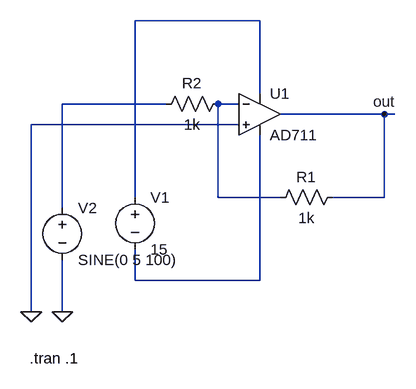
[diagram p0: schematic Amplifier.asc]
Amplifier.asc, the LTspice schematic file:
Version 4
SHEET 1 880 680
WIRE 192 16 0 16
WIRE 192 128 192 16
WIRE 48 144 -112 144
WIRE 160 144 128 144
WIRE 384 160 224 160
WIRE 400 160 384 160
WIRE 160 176 -160 176
WIRE 0 288 0 16
WIRE 128 288 128 144
WIRE 224 288 128 288
WIRE 384 288 384 160
WIRE 384 288 304 288
WIRE -112 304 -112 144
WIRE 0 416 0 368
WIRE 192 416 192 192
WIRE 192 416 0 416
WIRE -160 464 -160 176
WIRE -112 464 -112 384
FLAG 384 160 out
FLAG -160 464 0
FLAG -112 464 0
SYMBOL OpAmps\\AD711 192 96 R0
SYMATTR InstName U1
SYMBOL voltage 0 272 R0
WINDOW 123 0 0 Left 0
WINDOW 39 0 0 Left 0
SYMATTR InstName V1
SYMATTR Value 15
SYMBOL res 320 272 R90
WINDOW 0 0 56 VBottom 2
WINDOW 3 32 56 VTop 2
SYMATTR InstName R1
SYMATTR Value 1k
SYMBOL res 144 128 R90
WINDOW 0 0 56 VBottom 2
WINDOW 3 32 56 VTop 2
SYMATTR InstName R2
SYMATTR Value 1k
SYMBOL voltage -112 288 R0
WINDOW 123 0 0 Left 0
WINDOW 39 0 0 Left 0
SYMATTR InstName V2
SYMATTR Value SINE(0 5 100)
TEXT -162 536 Left 2 !.tran .1

The netlist it stands for:
* Amplifier.asc
XU1 0 N003 N001 N004 out AD712  ; AD711, pins In+ In- V+ V- OUT
V1 N001 N004 15
R1 out N003 1k
R2 N003 N002 1k
V2 N002 0 SINE(0 5 100)
.tran .1
.lib ADI1.lib
.backanno
.end